# EAGLE schematic vd_using_sym (EAGLE 9.7.0)
CNAME: GANDHI KALP
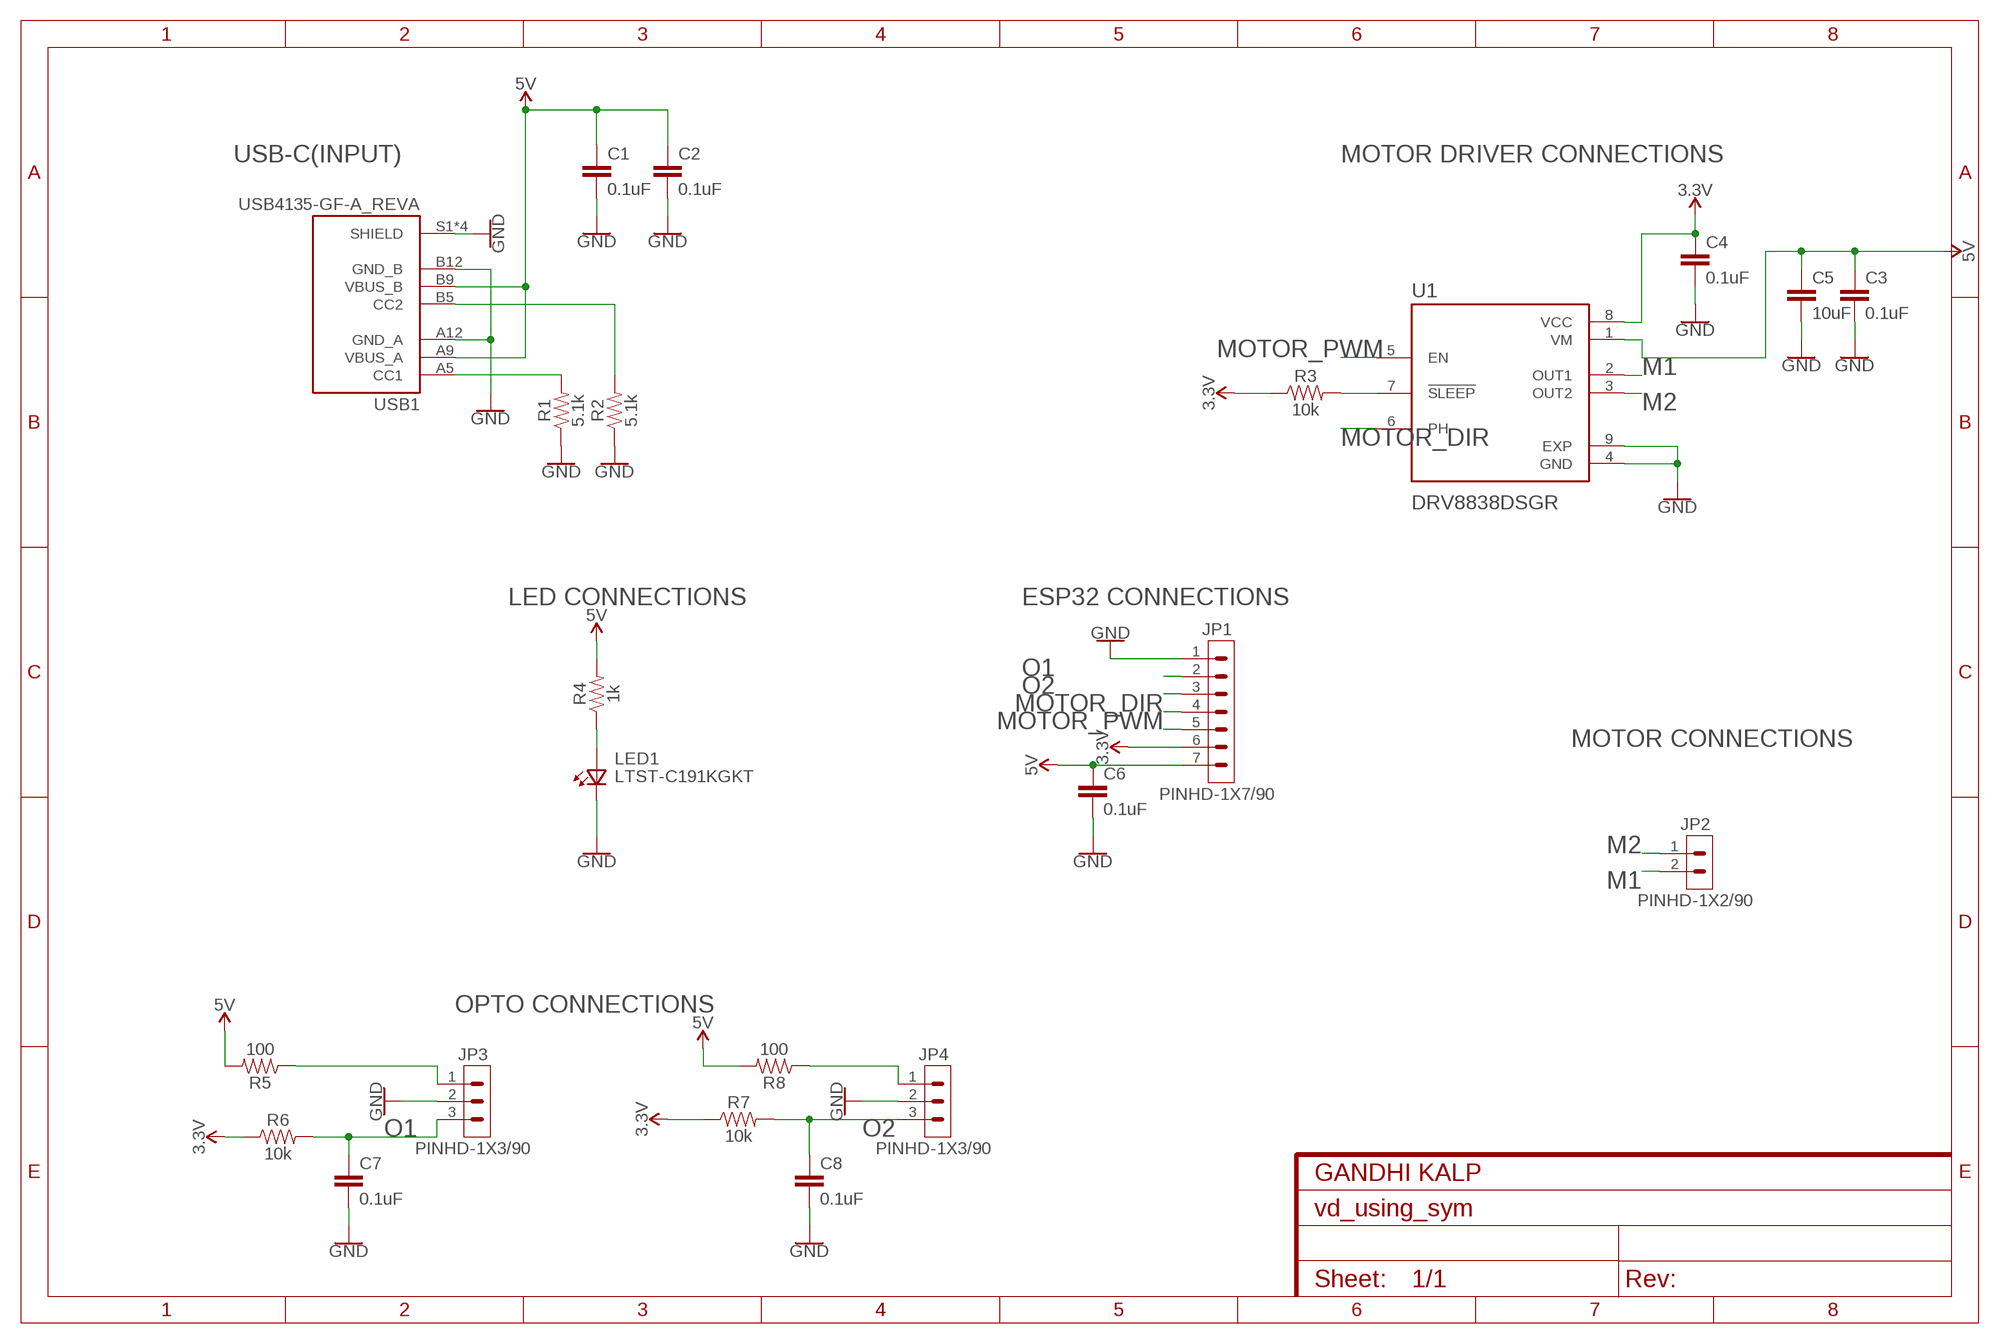
[diagram p0: schematic, sheet 1]

## Parts
C1  0.1uF  0.1UF-0402T-16V-10%-X7R-WE  [0402-TIGHT]
C2  0.1uF  0.1UF-0402T-16V-10%-X7R-WE  [0402-TIGHT]
C3  0.1uF  0.1UF-0402T-16V-10%-X7R-WE  [0402-TIGHT]
C4  0.1uF  0.1UF-0402T-16V-10%-X7R-WE  [0402-TIGHT]
C5  10uF  10UF-0805-25V-10%  [0805]
C6  0.1uF  0.1UF-0402T-16V-10%-X7R-WE  [0402-TIGHT]
C7  0.1uF  0.1UF-0402T-16V-10%-X7R-WE  [0402-TIGHT]
C8  0.1uF  0.1UF-0402T-16V-10%-X7R-WE  [0402-TIGHT]
JP1  PINHD-1X7/90  [1X07_90]
JP2  PINHD-1X2/90  [1X02_90]
JP3  PINHD-1X3/90  [1X03_90]
JP4  PINHD-1X3/90  [1X03_90]
LED1  LTST-C191KGKT  [0603]
R1  5.1k  5.1KOHM-0402T-1/16W-1%  [0402-TIGHT]
R2  5.1k  5.1KOHM-0402T-1/16W-1%  [0402-TIGHT]
R3  10k  10KOHM-0402T-1/16W-1%  [0402-TIGHT]
R4  1k  1KOHM-0402T-1/16W-1%  [0402-TIGHT]
R5  100  100OHM-0402-TIGHT-1/16W-1%  [0402-TIGHT]
R6  10k  10KOHM-0402T-1/16W-1%  [0402-TIGHT]
R7  10k  10KOHM-0402T-1/16W-1%  [0402-TIGHT]
R8  100  100OHM-0402-TIGHT-1/16W-1%  [0402-TIGHT]
U1  DRV8838DSGR  [SON50P200X200X80-9N]
USB1  USB4135-GF-A_REVA  [GCT_USB4135-GF-A_REVA]

## Nets
3.3V [Power]: C4.1 JP1.6 R3.1 R6.1 R7.1 U1.8(VCC)
5V [Power]: C1.1 C2.1 C3.1 C5.1 C6.1 JP1.7 R4.2 R5.2 R8.2 U1.1(VM) USB1.A9(VBUS_A) USB1.B9(VBUS_B)
GND [Power]: C1.2 C2.2 C3.2 C4.2 C5.2 C6.2 C7.2 C8.2 JP1.1 JP3.2 JP4.2 LED1.1(K2) R1.1 R2.1 U1.4(GND) U1.9(EXP) USB1.A12(GND_A) USB1.B12(GND_B) USB1.S1(SHIELD) USB1.S2(SHIELD) USB1.S3(SHIELD) USB1.S4(SHIELD)
M1 [Motor_connections]: JP2.2 U1.2(OUT1)
M2 [Motor_connections]: JP2.1 U1.3(OUT2)
MOTOR_DIR: JP1.4 U1.6(PH)
MOTOR_PWM: JP1.5 U1.5(EN)
N$1: R1.2 USB1.A5(CC1)
N$2: R2.2 USB1.B5(CC2)
N$3: R3.2 U1.7(!SLEEP)
N$4: LED1.2(A2) R4.1
N$5: JP3.1 R5.1
N$7: JP4.1 R8.1
O1: C7.1 JP1.2 JP3.3 R6.2
O2: C8.1 JP1.3 JP4.3 R7.2

## Notes on the sheet
- USB-C(INPUT)
- MOTOR DRIVER CONNECTIONS
- LED CONNECTIONS | ESP32 CONNECTIONS
- MOTOR CONNECTIONS
- OPTO CONNECTIONS

## Library data of the parts
C1-C4 C6-C8 = parts_req:0.1UF: 0.1µF ceramic capacitors A capacitor is a passive two-terminal electrical component used to store electrical energy temporarily in an electric field.; PROD_ID: CAP-16507
C5 = parts_req:10UF: 10.0µF ceramic capacitors A capacitor is a passive two-terminal electrical component used to store electrical energy temporarily in an electric field.; PROD_ID: CAP-14259
JP1 = parts_req:PINHD-1X7: Pin Header; CATEGORY: Connectors; DESCRIPTION: Header-Right Angle-7 Position; PACKAGE_TYPE: Through Hole; PITCH: 0.100" (2.54mm); SUBCATEGORY: Headers; TYPE: Male Pins
JP2 = parts_req:PINHD-1X2: Pin Header; CATEGORY: Connectors; DESCRIPTION: Header-Right Angle-2 Position; PACKAGE_TYPE: Through Hole; PITCH: 0.100" (2.54mm); SUBCATEGORY: Headers; TYPE: Male Pins
JP3 JP4 = parts_req:PINHD-1X3: Pin Header; CATEGORY: Connectors; DESCRIPTION: Header-Right Angle-3 Position; PACKAGE_TYPE: Through Hole; PITCH: 0.100" (2.54mm); SUBCATEGORY: Headers; TYPE: Male Pins
LED1 = parts_req:LTST-C191KGKT: Check availability <https://pricing.snapeda.com/parts/LTST-C191KGKT/Lite-On%20Electronics/view-part?ref=eda>; AVAILABILITY: In Stock; CHECK_PRICES: https://www.snapeda.com/parts/LTST-C191KGKT/Lite-On/view-part/?ref=eda; DESCRIPTION: Green 571nm LED Indication - Discrete 2V 0603 (1608 Metric); MF: Lite-On Electronics; MP: LTST-C191KGKT; PACKAGE: 0603 Lite-On Inc.; PRICE: None; SNAPEDA_LINK: https://www.snapeda.com/parts/LTST-C191KGKT/Lite-On/view-part/?ref=snap
R1 R2 = SparkFun-Resistors:5.1KOHM; PROD_ID: RES-14340
R3 R6 R7 = parts_req:10KOHM: 10kΩ resistor A resistor is a passive two-terminal electrical component that implements electrical resistance as a circuit element. Resistors act to reduce current flow, and, at the same time, act to lower voltage levels within circuits. - Wikipedia; PROD_ID: RES-14241
R4 = parts_req:1KOHM: 1kΩ resistor A resistor is a passive two-terminal electrical component that implements electrical resistance as a circuit element. Resistors act to reduce current flow, and, at the same time, act to lower voltage levels within circuits. - Wikipedia; PROD_ID: RES-14342
R5 R8 = parts_req:100OHM: 100Ω resistor A resistor is a passive two-terminal electrical component that implements electrical resistance as a circuit element. Resistors act to reduce current flow, and, at the same time, act to lower voltage levels within circuits. - Wikipedia; PROD_ID: RES-14962
U1 = parts_req:DRV8838DSGR: Check availability <https://pricing.snapeda.com/parts/DRV8838DSGR/Texas%20Instruments/view-part?ref=eda>; AVAILABILITY: In Stock; CHECK_PRICES: https://www.snapeda.com/parts/DRV8838DSGR/Texas+Instruments/view-part/?ref=eda; DESCRIPTION: 11-V, 1.8-A H-bridge motor driver with phase/enable control; MF: Texas Instruments; MP: DRV8838DSGR; PACKAGE: WSON-8 Texas Instruments; PRICE: None; PURCHASE-URL: https://www.snapeda.com/api/url_track_click_mouser/?unipart_id=230046&manufacturer=Texas Instruments&part_name=DRV8838DSGR&search_term=drv8838dsgr; SNAPEDA_LINK: https://www.snapeda.com/parts/DRV8838DSGR/Texas+Instruments/view-part/?ref=snap
USB1 = parts_req:USB4135-GF-A_REVA: Check availability <https://pricing.snapeda.com/parts/USB4135-GF-A/Global%20Connector%20Technology/view-part?ref=eda>; AVAILABILITY: In Stock; CHECK_PRICES: https://www.snapeda.com/parts/USB4135-GF-A/Global+Connector+Technology/view-part/?ref=eda; DESCRIPTION: Type C Receptacle, Horizontal, SMT, For Power Charging Only; MF: Global Connector Technology; MP: USB4135-GF-A; PACKAGE: None; PRICE: None; PURCHASE-URL: https://www.snapeda.com/api/url_track_click_mouser/?unipart_id=9604007&manufacturer=Global Connector Technology&part_name=USB4135-GF-A&search_term=type c usb power only; SNAPEDA_LINK: https://www.snapeda.com/parts/USB4135-GF-A/Global+Connector+Technology/view-part/?ref=snap

## Net classes
0 default: width 0.25 mm
1 Power: width 0.5 mm
2 Motor_connections: width 0.75 mm